# EAGLE schematic CoCoQuadLink (EAGLE 7.7.0)

## Sheet 1 of 7: LOGIC
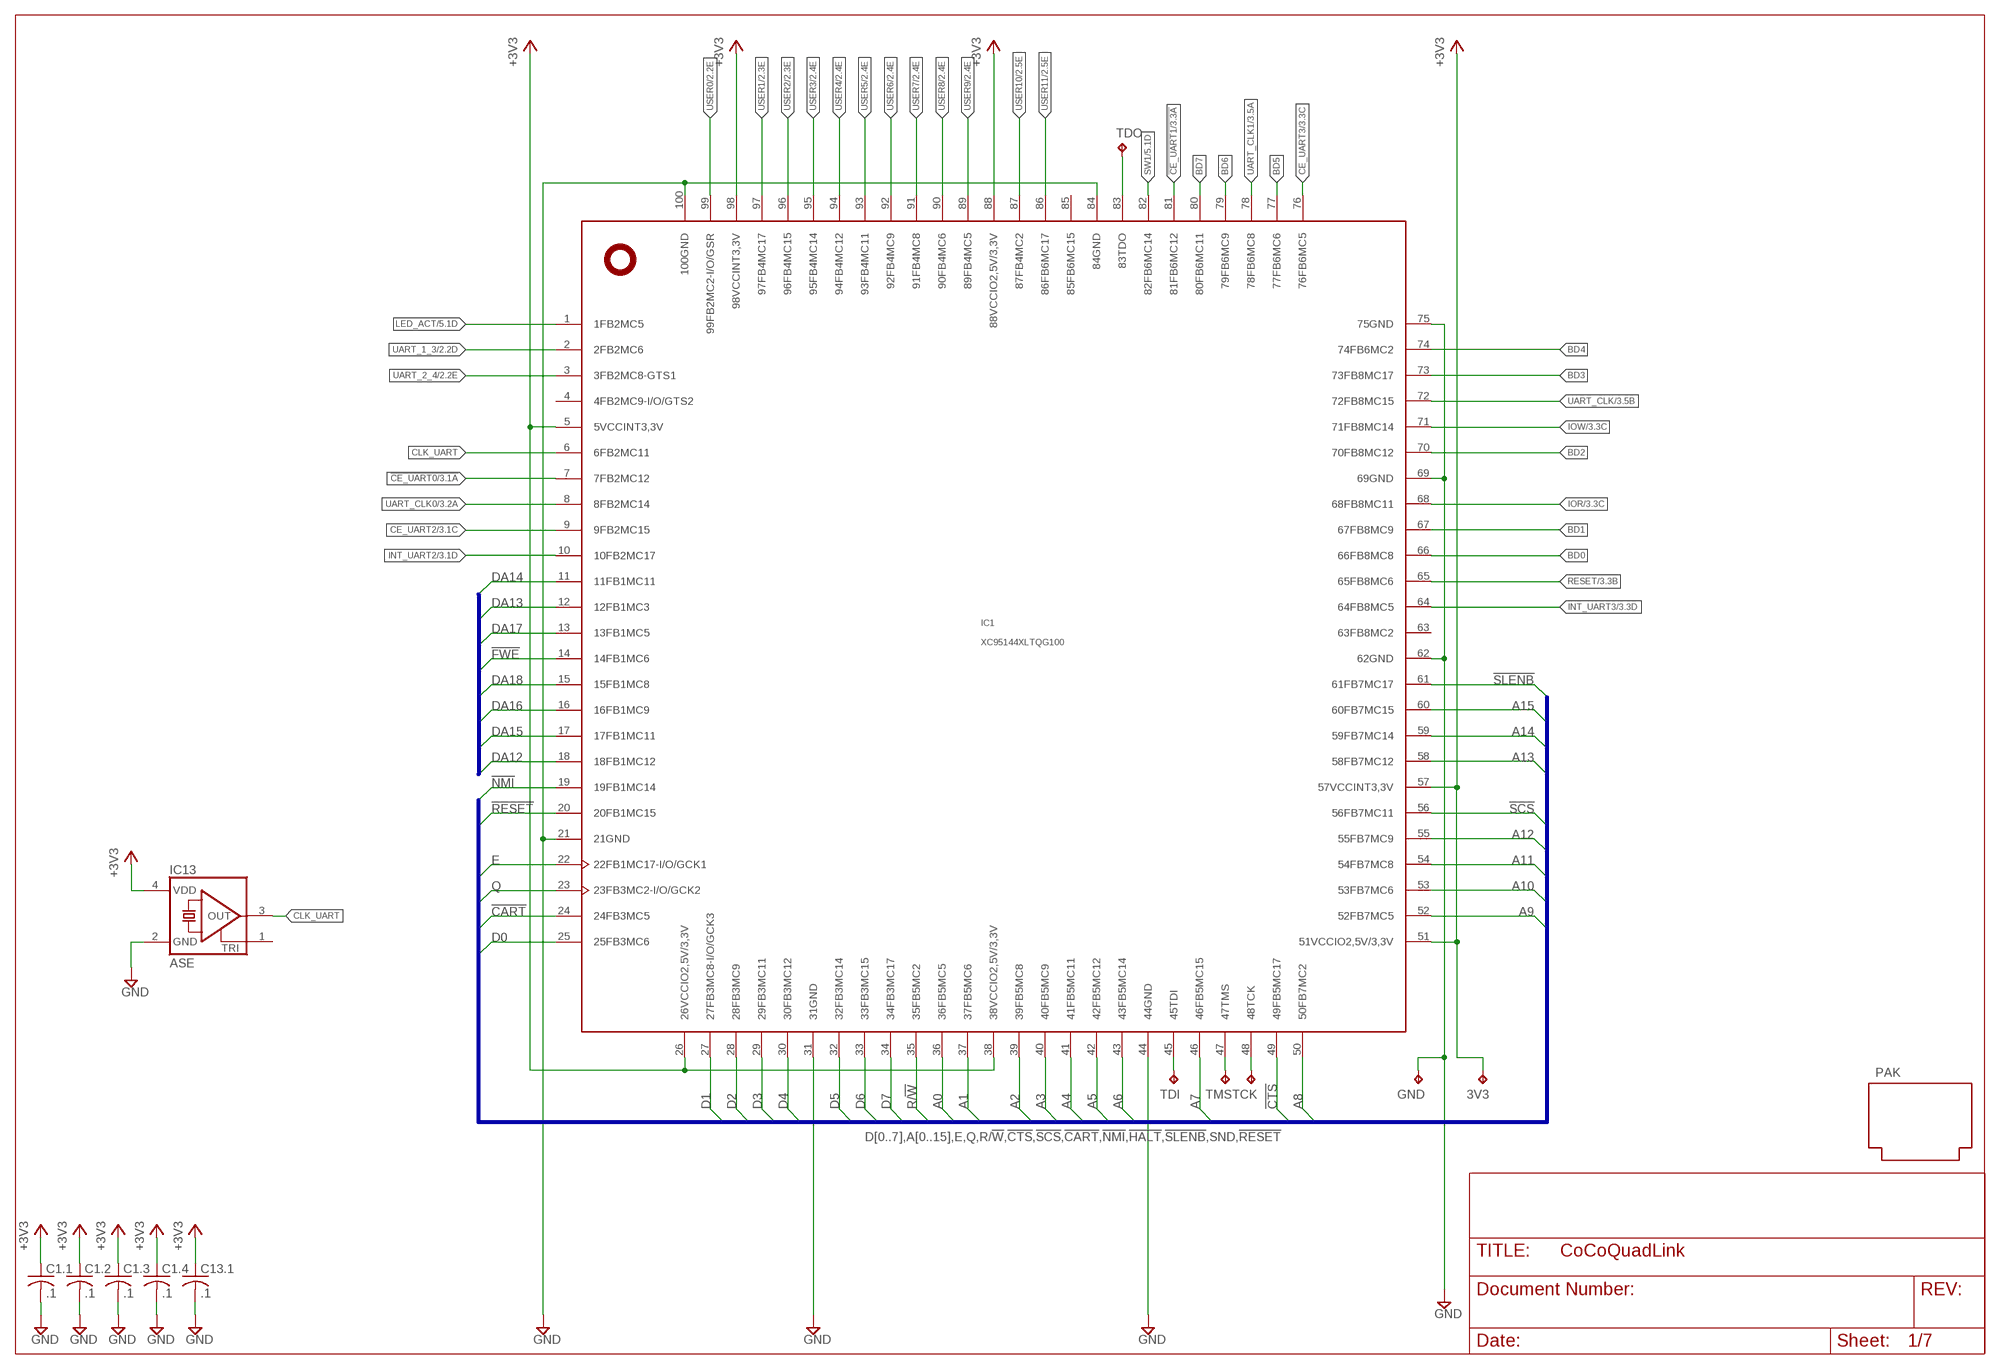
[diagram p0: schematic, sheet 1]

### Parts
3V3  TPTP10R  [TP10R]
C1.1  .1  C-USC0402  [C0402]
C1.2  .1  C-USC0402  [C0402]
C1.3  .1  C-USC0402  [C0402]
C1.4  .1  C-USC0402  [C0402]
C13.1  .1  C-USC0402  [C0402]
GND  TPTP10R  [TP10R]
IC1  XC95144XLTQG100  [TQFP100]
IC13  ASE  [ASE]
PAK  PROGRAM_PAK  [PROGRAM_PAK]
TCK  TPTP10R  [TP10R]
TDI  TPTP10R  [TP10R]
TDO  TPTP10R  [TP10R]
TMS  TPTP10R  [TP10R]

### Nets
!CART: IC1.24(24FB3MC5) ; also sheet 3,6
!CE_UART0: IC1.7(7FB2MC12) ; also sheet 3
!CE_UART1: IC1.81(81FB6MC12) ; also sheet 3
!CTS: IC1.49(49FB5MC17) ; also sheet 4,6
!FWE: IC1.14(14FB1MC6) ; also sheet 4
!NMI: IC1.19(19FB1MC14) ; also sheet 6
!RESET: IC1.20(20FB1MC15) ; also sheet 3,5,6
!SCS: IC1.56(56FB7MC11) ; also sheet 6
!SLENB: IC1.61(61FB7MC17) ; also sheet 6
+3V3: 3V3.TP C1.1.1 C1.2.1 C1.3.1 C1.4.1 C13.1.1 IC1.5(5VCCINT3,3V) IC1.26(26VCCIO2,5V/3,3V) IC1.38(38VCCIO2,5V/3,3V) IC1.51(51VCCIO2,5V/3,3V) IC1.57(57VCCINT3,3V) IC1.88(88VCCIO2,5V/3,3V) IC1.98(98VCCINT3,3V) IC13.4(VDD) ; also sheet 2,5,7
A0: IC1.36(36FB5MC5) ; also sheet 3,4,6
A1: IC1.37(37FB5MC6) ; also sheet 3,4,6
A2: IC1.39(39FB5MC8) ; also sheet 3,4,6
A3: IC1.40(40FB5MC9) ; also sheet 4,6
A4: IC1.41(41FB5MC11) ; also sheet 4,6
A5: IC1.42(42FB5MC12) ; also sheet 4,6
A6: IC1.43(43FB5MC14) ; also sheet 4,6
A7: IC1.46(46FB5MC15) ; also sheet 4,6
A8: IC1.50(50FB7MC2) ; also sheet 4,6
A9: IC1.52(52FB7MC5) ; also sheet 4,6
A10: IC1.53(53FB7MC6) ; also sheet 4,6
A11: IC1.54(54FB7MC8) ; also sheet 4,6
A12: IC1.55(55FB7MC9) ; also sheet 6
A13: IC1.58(58FB7MC12) ; also sheet 6
A14: IC1.59(59FB7MC14) ; also sheet 6
A15: IC1.60(60FB7MC15) ; also sheet 6
BD0: IC1.66(66FB8MC8) ; also sheet 3
BD1: IC1.67(67FB8MC9) ; also sheet 3
BD2: IC1.70(70FB8MC12) ; also sheet 3
BD3: IC1.73(73FB8MC17) ; also sheet 3
BD4: IC1.74(74FB6MC2) ; also sheet 3
BD5: IC1.77(77FB6MC6) ; also sheet 3
BD6: IC1.79(79FB6MC9) ; also sheet 3
BD7: IC1.80(80FB6MC11) ; also sheet 3
CE_UART2: IC1.9(9FB2MC15) ; also sheet 3
CE_UART3: IC1.76(76FB6MC5) ; also sheet 3
CLK_UART: IC1.6(6FB2MC11) IC13.3(OUT)
D0: IC1.25(25FB3MC6) ; also sheet 4,6
D1: IC1.27(27FB3MC8-I/O/GCK3) ; also sheet 4,6
D2: IC1.28(28FB3MC9) ; also sheet 4,6
D3: IC1.29(29FB3MC11) ; also sheet 4,6
D4: IC1.30(30FB3MC12) ; also sheet 4,6
D5: IC1.32(32FB3MC14) ; also sheet 4,6
D6: IC1.33(33FB3MC15) ; also sheet 4,6
D7: IC1.34(34FB3MC17) ; also sheet 4,6
DA12: IC1.18(18FB1MC12) ; also sheet 4
DA13: IC1.12(12FB1MC3) ; also sheet 4
DA14: IC1.11(11FB1MC11) ; also sheet 4
DA15: IC1.17(17FB1MC11) ; also sheet 4
DA16: IC1.16(16FB1MC9) ; also sheet 4
DA17: IC1.13(13FB1MC5) ; also sheet 4
DA18: IC1.15(15FB1MC8) ; also sheet 4
E: IC1.22(22FB1MC17-I/O/GCK1) ; also sheet 3,6
GND: C1.1.2 C1.2.2 C1.3.2 C1.4.2 C13.1.2 GND.TP IC1.21(21GND) IC1.31(31GND) IC1.44(44GND) IC1.62(62GND) IC1.69(69GND) IC1.75(75GND) IC1.84(84GND) IC1.100(100GND) IC13.2(GND) ; also sheet 2,3,4,5,6,7
INT_UART2: IC1.10(10FB2MC17) ; also sheet 3
INT_UART3: IC1.64(64FB8MC5) ; also sheet 3
IOR: IC1.68(68FB8MC11) ; also sheet 3
IOW: IC1.71(71FB8MC14) ; also sheet 3
LED_ACT: IC1.1(1FB2MC5) ; also sheet 5
N$5: IC1.45(45TDI) TDI.TP
N$6: IC1.47(47TMS) TMS.TP
N$7: IC1.48(48TCK) TCK.TP
N$8: IC1.83(83TDO) TDO.TP
Q: IC1.23(23FB3MC2-I/O/GCK2) ; also sheet 6
R/!W: IC1.35(35FB5MC2) ; also sheet 3,6
RESET: IC1.65(65FB8MC6) ; also sheet 3
SW1: IC1.82(82FB6MC14) ; also sheet 5
UART_1_3: IC1.2(2FB2MC6) ; also sheet 2
UART_2_4: IC1.3(3FB2MC8-GTS1) ; also sheet 2
UART_CLK: IC1.72(72FB8MC15) ; also sheet 3
UART_CLK0: IC1.8(8FB2MC14) ; also sheet 3
UART_CLK1: IC1.78(78FB6MC8) ; also sheet 3
USER0: IC1.99(99FB2MC2-I/O/GSR) ; also sheet 2
USER1: IC1.97(97FB4MC17) ; also sheet 2
USER2: IC1.96(96FB4MC15) ; also sheet 2
USER3: IC1.95(95FB4MC14) ; also sheet 2
USER4: IC1.94(94FB4MC12) ; also sheet 2
USER5: IC1.93(93FB4MC11) ; also sheet 2
USER6: IC1.92(92FB4MC9) ; also sheet 2
USER7: IC1.91(91FB4MC8) ; also sheet 2
USER8: IC1.90(90FB4MC6) ; also sheet 2
USER9: IC1.89(89FB4MC5) ; also sheet 2
USER10: IC1.87(87FB4MC2) ; also sheet 2
USER11: IC1.86(86FB6MC17) ; also sheet 2
Unconnected: IC1.4(4FB2MC9-I/O/GTS2) IC1.63(63FB8MC2) IC1.85(85FB6MC15) IC13.1(TRI)

### Buses
D[0..7],A[0..15],E,Q,R/!W,!CTS,!SCS,!CART,!NMI,!HALT,!SLENB,SND,!RESET
!FWE,DA[12..18]

## Sheet 2 of 7: MUX
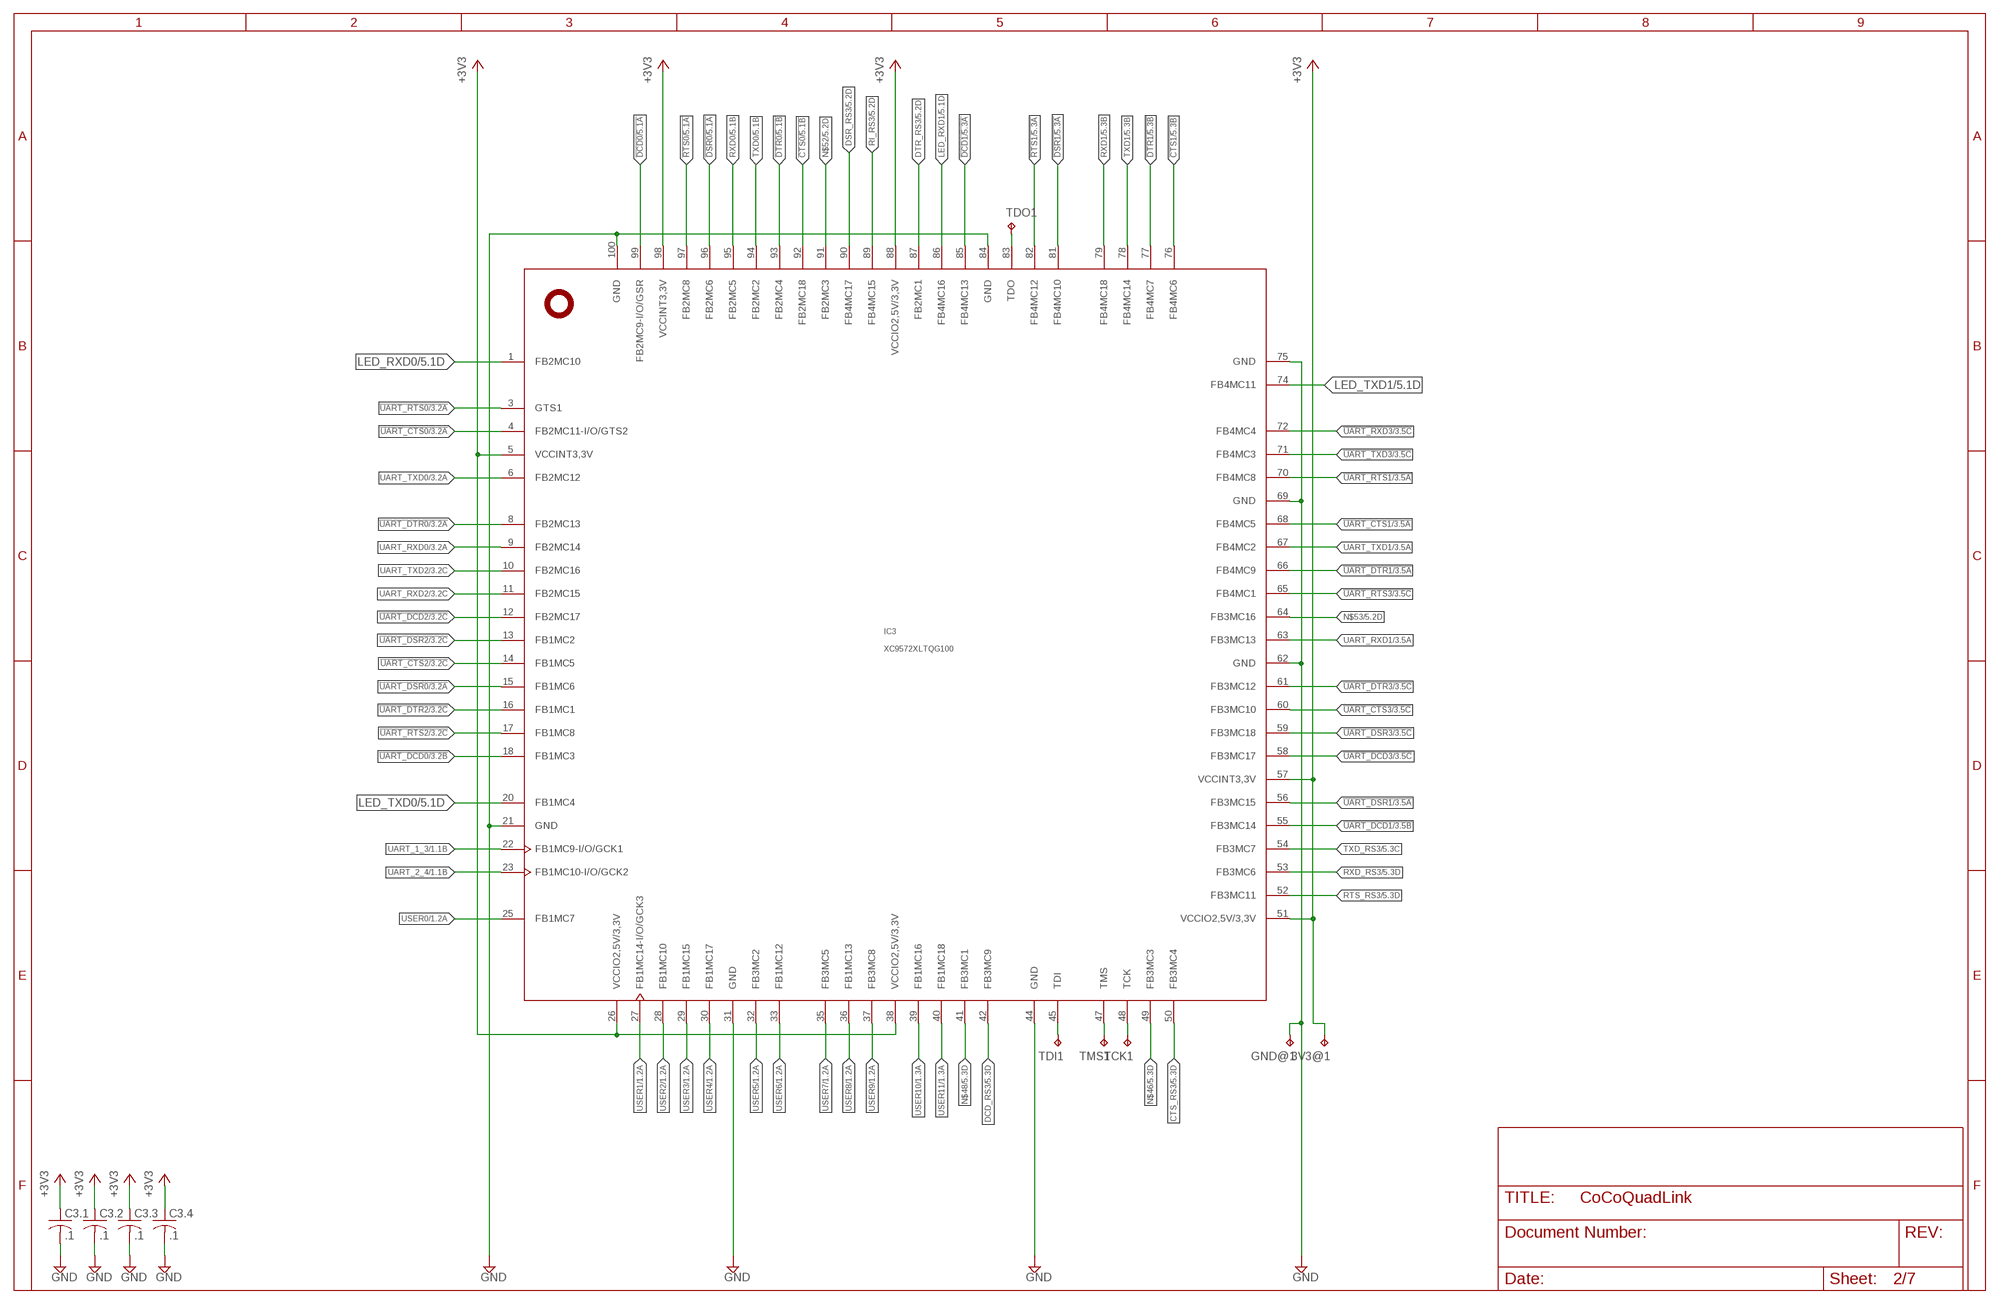
[diagram p1: schematic, sheet 2]

### Parts
3V3@1  TPTP10R  [TP10R]
C3.1  .1  C-USC0402  [C0402]
C3.2  .1  C-USC0402  [C0402]
C3.3  .1  C-USC0402  [C0402]
C3.4  .1  C-USC0402  [C0402]
GND@1  TPTP10R  [TP10R]
IC3  XC9572XLTQG100  [TQFP100]
TCK1  TPTP10R  [TP10R]
TDI1  TPTP10R  [TP10R]
TDO1  TPTP10R  [TP10R]
TMS1  TPTP10R  [TP10R]

### Nets
!CTS0: IC3.92(FB2MC18) ; also sheet 5
!CTS1: IC3.76(FB4MC6) ; also sheet 5
!DCD0: IC3.99(FB2MC9-I/O/GSR) ; also sheet 5
!DCD1: IC3.85(FB4MC13) ; also sheet 5
!DSR0: IC3.96(FB2MC6) ; also sheet 5
!DSR1: IC3.81(FB4MC10) ; also sheet 5
!DTR0: IC3.93(FB2MC4) ; also sheet 5
!DTR1: IC3.77(FB4MC7) ; also sheet 5
!RTS0: IC3.97(FB2MC8) ; also sheet 5
!RTS1: IC3.82(FB4MC12) ; also sheet 5
!UART_CTS0: IC3.4(FB2MC11-I/O/GTS2) ; also sheet 3
!UART_CTS1: IC3.68(FB4MC5) ; also sheet 3
!UART_CTS2: IC3.14(FB1MC5) ; also sheet 3
!UART_CTS3: IC3.60(FB3MC10) ; also sheet 3
!UART_DCD0: IC3.18(FB1MC3) ; also sheet 3
!UART_DCD1: IC3.55(FB3MC14) ; also sheet 3
!UART_DCD2: IC3.12(FB2MC17) ; also sheet 3
!UART_DCD3: IC3.58(FB3MC17) ; also sheet 3
!UART_DSR0: IC3.15(FB1MC6) ; also sheet 3
!UART_DSR1: IC3.56(FB3MC15) ; also sheet 3
!UART_DSR2: IC3.13(FB1MC2) ; also sheet 3
!UART_DSR3: IC3.59(FB3MC18) ; also sheet 3
!UART_DTR0: IC3.8(FB2MC13) ; also sheet 3
!UART_DTR1: IC3.66(FB4MC9) ; also sheet 3
!UART_DTR2: IC3.16(FB1MC1) ; also sheet 3
!UART_DTR3: IC3.61(FB3MC12) ; also sheet 3
!UART_RTS0: IC3.3(GTS1) ; also sheet 3
!UART_RTS1: IC3.70(FB4MC8) ; also sheet 3
!UART_RTS2: IC3.17(FB1MC8) ; also sheet 3
!UART_RTS3: IC3.65(FB4MC1) ; also sheet 3
!UART_RXD3: IC3.72(FB4MC4) ; also sheet 3
!UART_TXD3: IC3.71(FB4MC3) ; also sheet 3
+3V3: 3V3@1.TP C3.1.1 C3.2.1 C3.3.1 C3.4.1 IC3.5(VCCINT3,3V) IC3.26(VCCIO2,5V/3,3V) IC3.38(VCCIO2,5V/3,3V) IC3.51(VCCIO2,5V/3,3V) IC3.57(VCCINT3,3V) IC3.88(VCCIO2,5V/3,3V) IC3.98(VCCINT3,3V) ; also sheet 1,5,7
CTS_RS3: IC3.50(FB3MC4) ; also sheet 5
DCD_RS3: IC3.42(FB3MC9) ; also sheet 5
DSR_RS3: IC3.90(FB4MC17) ; also sheet 5
DTR_RS3: IC3.87(FB2MC1) ; also sheet 5
GND: C3.1.2 C3.2.2 C3.3.2 C3.4.2 GND@1.TP IC3.21(GND) IC3.31(GND) IC3.44(GND) IC3.62(GND) IC3.69(GND) IC3.75(GND) IC3.84(GND) IC3.100(GND) ; also sheet 1,3,4,5,6,7
LED_RXD0: IC3.1(FB2MC10) ; also sheet 5
LED_RXD1: IC3.86(FB4MC16) ; also sheet 5
LED_TXD0: IC3.20(FB1MC4) ; also sheet 5
LED_TXD1: IC3.74(FB4MC11) ; also sheet 5
N$11: IC3.83(TDO) TDO1.TP
N$12: IC3.45(TDI) TDI1.TP
N$30: IC3.47(TMS) TMS1.TP
N$32: IC3.48(TCK) TCK1.TP
N$46: IC3.49(FB3MC3) ; also sheet 5
N$48: IC3.41(FB3MC1) ; also sheet 5
N$52: IC3.91(FB2MC3) ; also sheet 5
N$53: IC3.64(FB3MC16) ; also sheet 5
RI_RS3: IC3.89(FB4MC15) ; also sheet 5
RTS_RS3: IC3.52(FB3MC11) ; also sheet 5
RXD0: IC3.95(FB2MC5) ; also sheet 5
RXD1: IC3.79(FB4MC18) ; also sheet 5
RXD_RS3: IC3.53(FB3MC6) ; also sheet 5
TXD0: IC3.94(FB2MC2) ; also sheet 5
TXD1: IC3.78(FB4MC14) ; also sheet 5
TXD_RS3: IC3.54(FB3MC7) ; also sheet 5
UART_1_3: IC3.22(FB1MC9-I/O/GCK1) ; also sheet 1
UART_2_4: IC3.23(FB1MC10-I/O/GCK2) ; also sheet 1
UART_RXD0: IC3.9(FB2MC14) ; also sheet 3
UART_RXD1: IC3.63(FB3MC13) ; also sheet 3
UART_RXD2: IC3.11(FB2MC15) ; also sheet 3
UART_TXD0: IC3.6(FB2MC12) ; also sheet 3
UART_TXD1: IC3.67(FB4MC2) ; also sheet 3
UART_TXD2: IC3.10(FB2MC16) ; also sheet 3
USER0: IC3.25(FB1MC7) ; also sheet 1
USER1: IC3.27(FB1MC14-I/O/GCK3) ; also sheet 1
USER2: IC3.28(FB1MC10) ; also sheet 1
USER3: IC3.29(FB1MC15) ; also sheet 1
USER4: IC3.30(FB1MC17) ; also sheet 1
USER5: IC3.32(FB3MC2) ; also sheet 1
USER6: IC3.33(FB1MC12) ; also sheet 1
USER7: IC3.35(FB3MC5) ; also sheet 1
USER8: IC3.36(FB1MC13) ; also sheet 1
USER9: IC3.37(FB3MC8) ; also sheet 1
USER10: IC3.39(FB1MC16) ; also sheet 1
USER11: IC3.40(FB1MC18) ; also sheet 1

## Sheet 3 of 7: UART
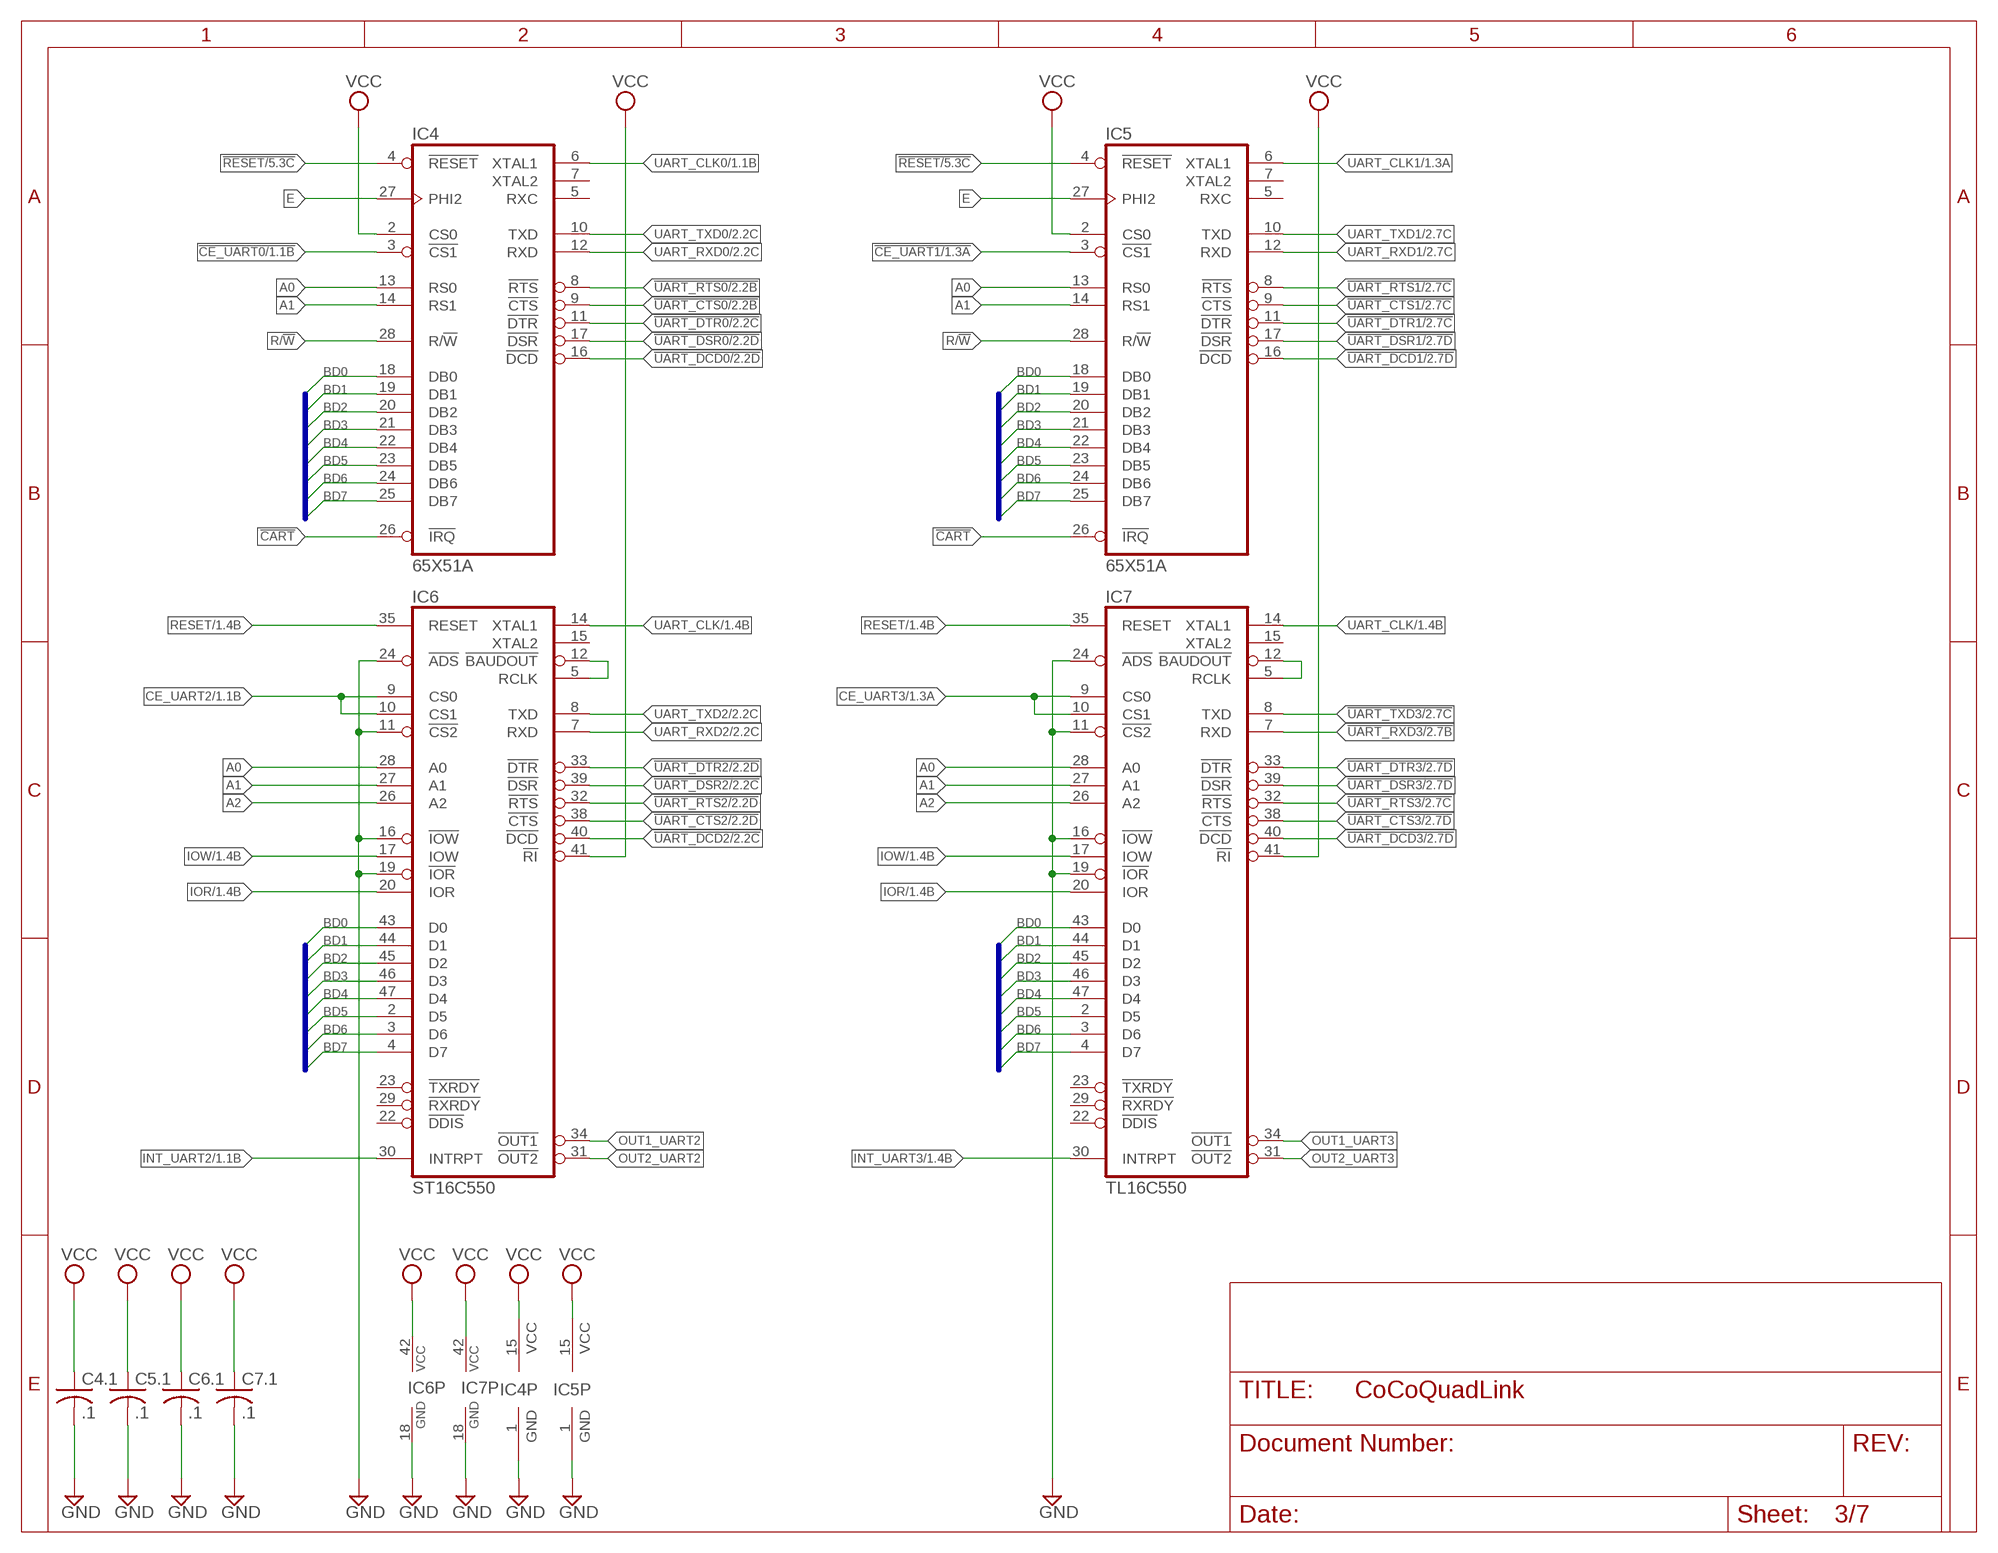
[diagram p2: schematic, sheet 3]

### Parts
C4.1  .1  C-USC0402  [C0402]
C5.1  .1  C-USC0402  [C0402]
C6.1  .1  C-USC0402  [C0402]
C7.1  .1  C-USC0402  [C0402]
IC4  65X51A  6551NR  [DIL28-ROUNDPAD]
IC5  65X51A  6551NR  [DIL28-ROUNDPAD]
IC6  ST16C550  TLC550PT  [LQFP48]
IC7  TL16C550  TLC550PT  [LQFP48]

### Nets
!CART: IC4.26(!IRQ) IC5.26(!IRQ) ; also sheet 1,6
!CE_UART0: IC4.3(!CS1) ; also sheet 1
!CE_UART1: IC5.3(!CS1) ; also sheet 1
!RESET: IC4.4(!RESET) IC5.4(!RESET) ; also sheet 1,5,6
!UART_CTS0: IC4.9(!CTS) ; also sheet 2
!UART_CTS1: IC5.9(!CTS) ; also sheet 2
!UART_CTS2: IC6.38(!CTS) ; also sheet 2
!UART_CTS3: IC7.38(!CTS) ; also sheet 2
!UART_DCD0: IC4.16(!DCD) ; also sheet 2
!UART_DCD1: IC5.16(!DCD) ; also sheet 2
!UART_DCD2: IC6.40(!DCD) ; also sheet 2
!UART_DCD3: IC7.40(!DCD) ; also sheet 2
!UART_DSR0: IC4.17(!DSR) ; also sheet 2
!UART_DSR1: IC5.17(!DSR) ; also sheet 2
!UART_DSR2: IC6.39(!DSR) ; also sheet 2
!UART_DSR3: IC7.39(!DSR) ; also sheet 2
!UART_DTR0: IC4.11(!DTR) ; also sheet 2
!UART_DTR1: IC5.11(!DTR) ; also sheet 2
!UART_DTR2: IC6.33(!DTR) ; also sheet 2
!UART_DTR3: IC7.33(!DTR) ; also sheet 2
!UART_RTS0: IC4.8(!RTS) ; also sheet 2
!UART_RTS1: IC5.8(!RTS) ; also sheet 2
!UART_RTS2: IC6.32(!RTS) ; also sheet 2
!UART_RTS3: IC7.32(!RTS) ; also sheet 2
!UART_RXD3: IC7.7(RXD) ; also sheet 2
!UART_TXD3: IC7.8(TXD) ; also sheet 2
A0: IC4.13(RS0) IC5.13(RS0) IC6.28(A0) IC7.28(A0) ; also sheet 1,4,6
A1: IC4.14(RS1) IC5.14(RS1) IC6.27(A1) IC7.27(A1) ; also sheet 1,4,6
A2: IC6.26(A2) IC7.26(A2) ; also sheet 1,4,6
BD0: IC4.18(DB0) IC5.18(DB0) IC6.43(D0) IC7.43(D0) ; also sheet 1
BD1: IC4.19(DB1) IC5.19(DB1) IC6.44(D1) IC7.44(D1) ; also sheet 1
BD2: IC4.20(DB2) IC5.20(DB2) IC6.45(D2) IC7.45(D2) ; also sheet 1
BD3: IC4.21(DB3) IC5.21(DB3) IC6.46(D3) IC7.46(D3) ; also sheet 1
BD4: IC4.22(DB4) IC5.22(DB4) IC6.47(D4) IC7.47(D4) ; also sheet 1
BD5: IC4.23(DB5) IC5.23(DB5) IC6.2(D5) IC7.2(D5) ; also sheet 1
BD6: IC4.24(DB6) IC5.24(DB6) IC6.3(D6) IC7.3(D6) ; also sheet 1
BD7: IC4.25(DB7) IC5.25(DB7) IC6.4(D7) IC7.4(D7) ; also sheet 1
CE_UART2: IC6.9(CS0) IC6.10(CS1) ; also sheet 1
CE_UART3: IC7.9(CS0) IC7.10(CS1) ; also sheet 1
E: IC4.27(PHI2) IC5.27(PHI2) ; also sheet 1,6
GND: C4.1.2 C5.1.2 C6.1.2 C7.1.2 IC4.1(GND) IC5.1(GND) IC6.11(!CS2) IC6.16(!IOW) IC6.18(GND) IC6.19(!IOR) IC6.24(!ADS) IC7.11(!CS2) IC7.16(!IOW) IC7.18(GND) IC7.19(!IOR) IC7.24(!ADS) ; also sheet 1,2,4,5,6,7
INT_UART2: IC6.30(INTRPT) ; also sheet 1
INT_UART3: IC7.30(INTRPT) ; also sheet 1
IOR: IC6.20(IOR) IC7.20(IOR) ; also sheet 1
IOW: IC6.17(IOW) IC7.17(IOW) ; also sheet 1
N$33: IC6.5(RCLK) IC6.12(!BAUDOUT)
N$35: IC7.5(RCLK) IC7.12(!BAUDOUT)
OUT1_UART2: IC6.34(!OUT1)
OUT1_UART3: IC7.34(!OUT1)
OUT2_UART2: IC6.31(!OUT2)
OUT2_UART3: IC7.31(!OUT2)
R/!W: IC4.28(R/!W) IC5.28(R/!W) ; also sheet 1,6
RESET: IC6.35(RESET) IC7.35(RESET) ; also sheet 1
UART_CLK: IC6.14(XTAL1) IC7.14(XTAL1) ; also sheet 1
UART_CLK0: IC4.6(XTAL1) ; also sheet 1
UART_CLK1: IC5.6(XTAL1) ; also sheet 1
UART_RXD0: IC4.12(RXD) ; also sheet 2
UART_RXD1: IC5.12(RXD) ; also sheet 2
UART_RXD2: IC6.7(RXD) ; also sheet 2
UART_TXD0: IC4.10(TXD) ; also sheet 2
UART_TXD1: IC5.10(TXD) ; also sheet 2
UART_TXD2: IC6.8(TXD) ; also sheet 2
VCC: C4.1.1 C5.1.1 C6.1.1 C7.1.1 IC4.2(CS0) IC4.15(VCC) IC5.2(CS0) IC5.15(VCC) IC6.41(!RI) IC6.42(VCC) IC7.41(!RI) IC7.42(VCC) ; also sheet 4,5,6,7
Unconnected: IC4.5(RXC) IC4.7(XTAL2) IC5.5(RXC) IC5.7(XTAL2) IC6.15(XTAL2) IC6.22(!DDIS) IC6.23(!TXRDY) IC6.29(!RXRDY) IC7.15(XTAL2) IC7.22(!DDIS) IC7.23(!TXRDY) IC7.29(!RXRDY)

### Buses
BD[0..7]

## Sheet 4 of 7: MEMORY
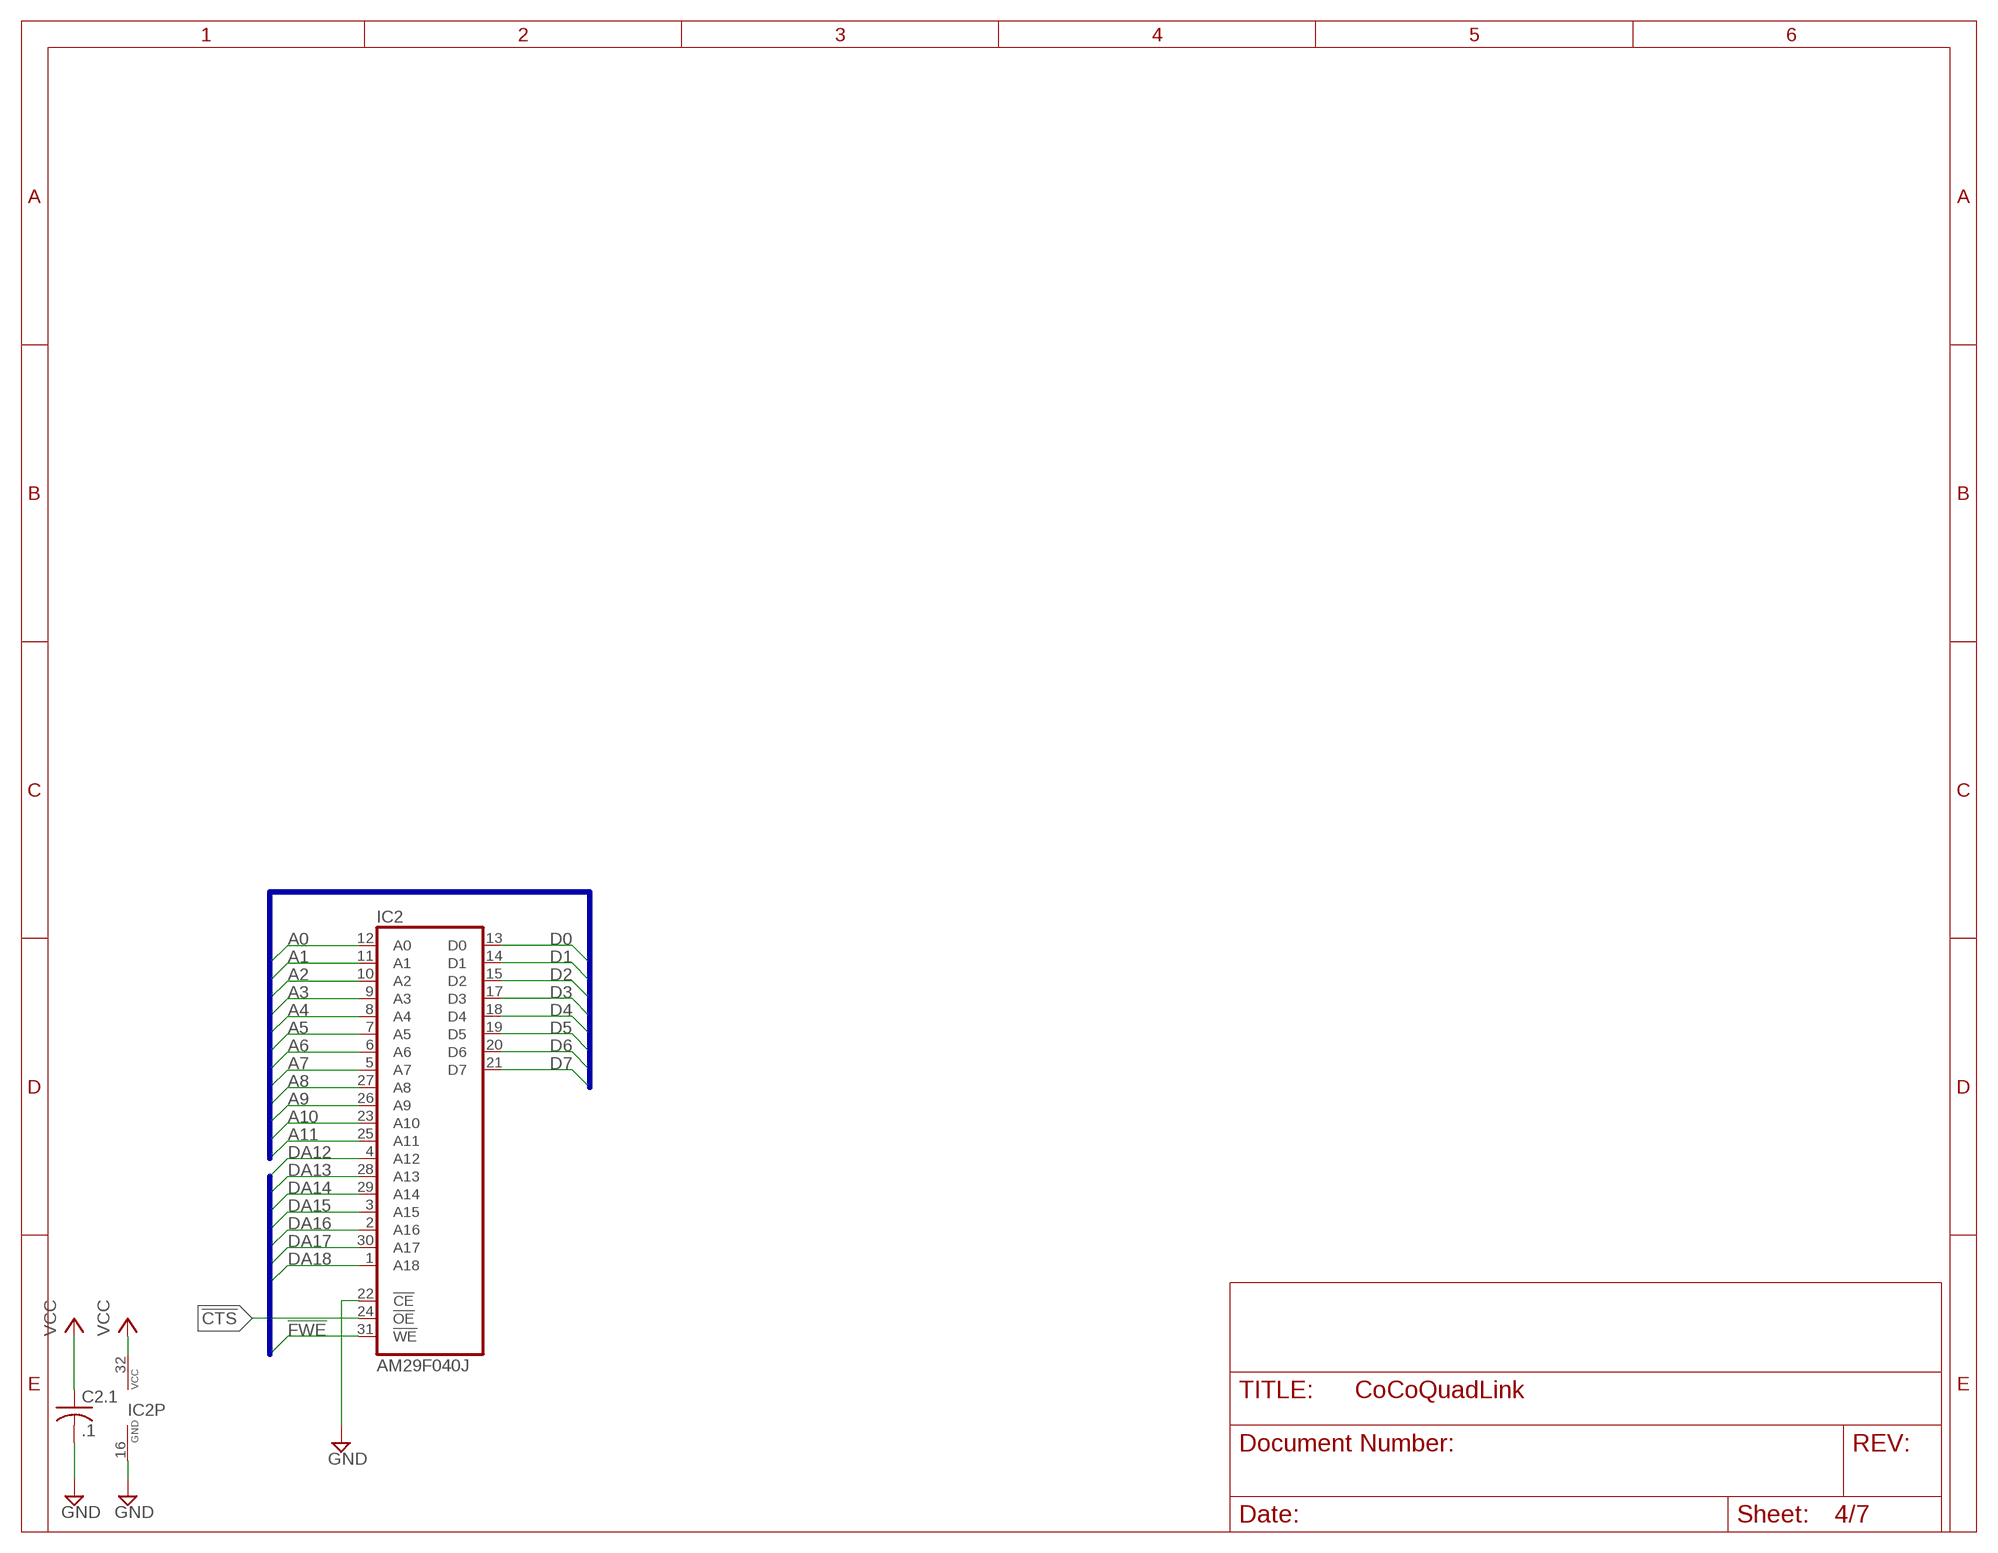
[diagram p3: schematic, sheet 4]

### Parts
C2.1  .1  C-USC0402  [C0402]
IC2  AM29F040J  [PLCC32R]

### Nets
!CTS: IC2.24(!OE) ; also sheet 1,6
!FWE: IC2.31(!WE) ; also sheet 1
A0: IC2.12(A0) ; also sheet 1,3,6
A1: IC2.11(A1) ; also sheet 1,3,6
A2: IC2.10(A2) ; also sheet 1,3,6
A3: IC2.9(A3) ; also sheet 1,6
A4: IC2.8(A4) ; also sheet 1,6
A5: IC2.7(A5) ; also sheet 1,6
A6: IC2.6(A6) ; also sheet 1,6
A7: IC2.5(A7) ; also sheet 1,6
A8: IC2.27(A8) ; also sheet 1,6
A9: IC2.26(A9) ; also sheet 1,6
A10: IC2.23(A10) ; also sheet 1,6
A11: IC2.25(A11) ; also sheet 1,6
D0: IC2.13(D0) ; also sheet 1,6
D1: IC2.14(D1) ; also sheet 1,6
D2: IC2.15(D2) ; also sheet 1,6
D3: IC2.17(D3) ; also sheet 1,6
D4: IC2.18(D4) ; also sheet 1,6
D5: IC2.19(D5) ; also sheet 1,6
D6: IC2.20(D6) ; also sheet 1,6
D7: IC2.21(D7) ; also sheet 1,6
DA12: IC2.4(A12) ; also sheet 1
DA13: IC2.28(A13) ; also sheet 1
DA14: IC2.29(A14) ; also sheet 1
DA15: IC2.3(A15) ; also sheet 1
DA16: IC2.2(A16) ; also sheet 1
DA17: IC2.30(A17) ; also sheet 1
DA18: IC2.1(A18) ; also sheet 1
GND: C2.1.2 IC2.16(GND) IC2.22(!CE) ; also sheet 1,2,3,5,6,7
VCC: C2.1.1 IC2.32(VCC) ; also sheet 3,5,6,7

### Buses
!FWE,DA[12..18]
D[0..7],A[0..15],E,Q,R/!W,!CTS,!SCS,!CART,!NMI,!HALT,!SLENB,SND,!RESET

## Sheet 5 of 7: IO
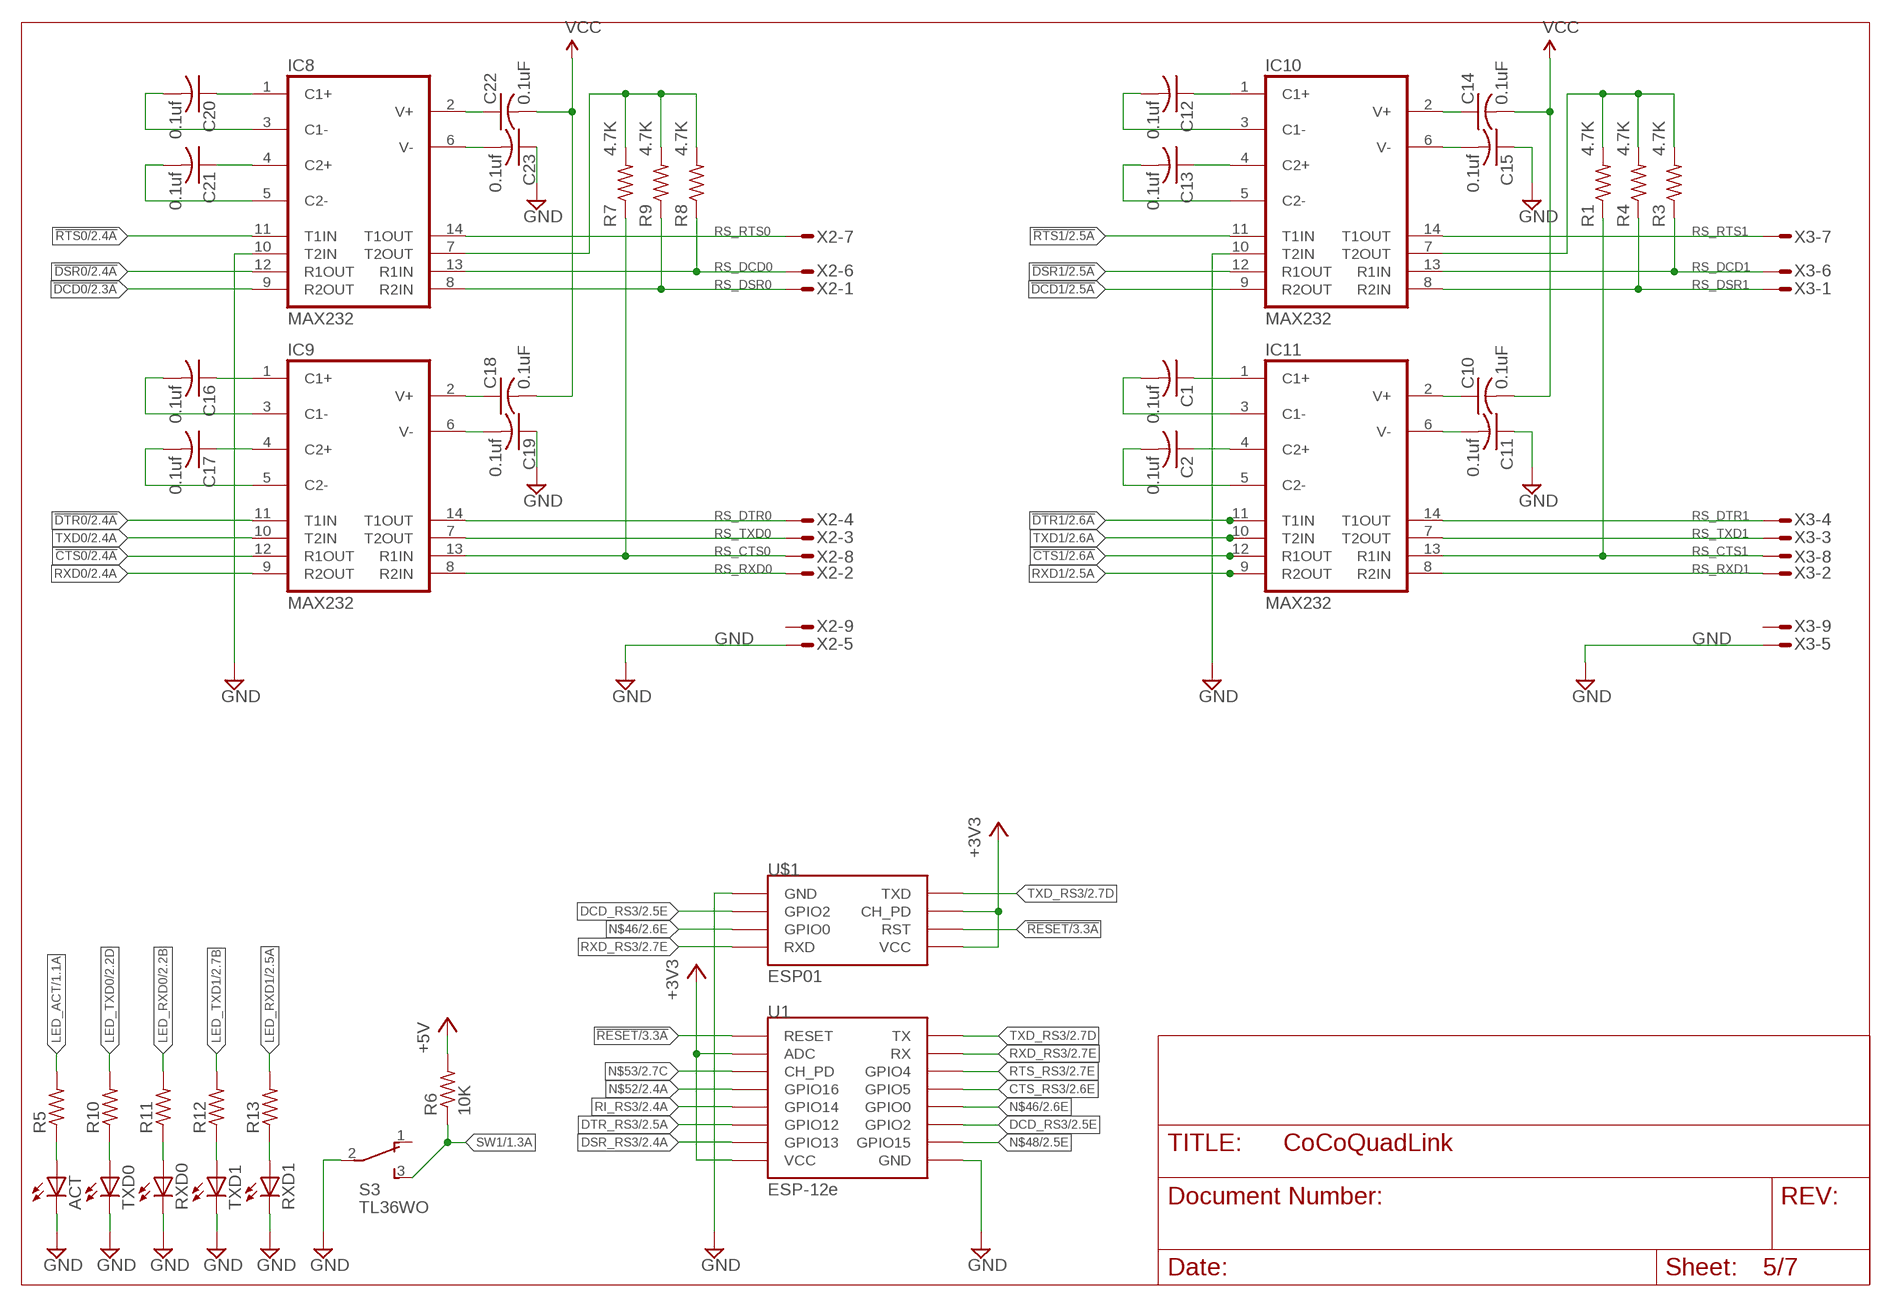
[diagram p4: schematic, sheet 5]

### Parts
ACT  LED3MM  [LED3MM]
C1  0.1uf  C-USC0402  [C0402]
C2  0.1uf  C-USC0402  [C0402]
C10  0.1uF  C-USC0402  [C0402]
C11  0.1uf  C-USC0402  [C0402]
C12  0.1uf  C-USC0402  [C0402]
C13  0.1uf  C-USC0402  [C0402]
C14  0.1uF  C-USC0402  [C0402]
C15  0.1uf  C-USC0402  [C0402]
C16  0.1uf  C-USC0402  [C0402]
C17  0.1uf  C-USC0402  [C0402]
C18  0.1uF  C-USC0402  [C0402]
C19  0.1uf  C-USC0402  [C0402]
C20  0.1uf  C-USC0402  [C0402]
C21  0.1uf  C-USC0402  [C0402]
C22  0.1uF  C-USC0402  [C0402]
C23  0.1uf  C-USC0402  [C0402]
IC8  MAX232  MAX3232CSE  [SO16]
IC9  MAX232  MAX3232CSE  [SO16]
IC10  MAX232  MAX3232CSE  [SO16]
IC11  MAX232  MAX3232CSE  [SO16]
R1  4.7K  R-US_R1206  [R1206]
R3  4.7K  R-US_R1206  [R1206]
R4  4.7K  R-US_R1206  [R1206]
R5  R-US_R0402  [R0402]
R6  10K  R-US_R0402  [R0402]
R7  4.7K  R-US_R1206  [R1206]
R8  4.7K  R-US_R1206  [R1206]
R9  4.7K  R-US_R1206  [R1206]
R10  R-US_R0402  [R0402]
R11  R-US_R0402  [R0402]
R12  R-US_R0402  [R0402]
R13  R-US_R0402  [R0402]
RXD0  LED3MM  [LED3MM]
RXD1  LED3MM  [LED3MM]
S3  TL36WO  [TL3XWO]
TXD0  LED3MM  [LED3MM]
TXD1  LED3MM  [LED3MM]
U1  ESP-12e  ESP12  [ESP12]
U$1  ESP01  [ESP01]
X2  M09DS  [M09D]
X3  M09DS  [M09D]

### Nets
!CTS0: IC9.12(R1OUT) ; also sheet 2
!CTS1: IC11.12(R1OUT) ; also sheet 2
!DCD0: IC8.9(R2OUT) ; also sheet 2
!DCD1: IC10.9(R2OUT) ; also sheet 2
!DSR0: IC8.12(R1OUT) ; also sheet 2
!DSR1: IC10.12(R1OUT) ; also sheet 2
!DTR0: IC9.11(T1IN) ; also sheet 2
!DTR1: IC11.11(T1IN) ; also sheet 2
!RESET: U1.RESET U$1.RST ; also sheet 1,3,6
!RTS0: IC8.11(T1IN) ; also sheet 2
!RTS1: IC10.11(T1IN) ; also sheet 2
+3V3: U1.ADC U1.VCC U$1.CH_PD U$1.VCC ; also sheet 1,2,7
CTS_RS3: U1.GPIO5 ; also sheet 2
DCD_RS3: U1.GPIO2 U$1.GPIO2 ; also sheet 2
DSR_RS3: U1.GPIO13 ; also sheet 2
DTR_RS3: U1.GPIO12 ; also sheet 2
GND: ACT.K(C) C11.1 C15.1 C19.1 C23.1 IC8.10(T2IN) IC10.10(T2IN) RXD0.K(C) RXD1.K(C) S3.2(P) TXD0.K(C) TXD1.K(C) U1.GND U$1.GND X2.5 X3.5 ; also sheet 1,2,3,4,6,7
LED_ACT: R5.2 ; also sheet 1
LED_RXD0: R11.2 ; also sheet 2
LED_RXD1: R13.2 ; also sheet 2
LED_TXD0: R10.2 ; also sheet 2
LED_TXD1: R12.2 ; also sheet 2
N$1: ACT.A R5.1
N$2: C16.1 IC9.1(C1+)
N$3: C16.2 IC9.3(C1-)
N$4: C17.1 IC9.4(C2+)
N$9: C17.2 IC9.5(C2-)
N$10: IC10.7(T2OUT) R1.2 R3.2 R4.2
N$13: C1.1 IC11.1(C1+)
N$14: C18.1 IC9.2(V+)
N$15: C19.2 IC9.6(V-)
N$16: C20.1 IC8.1(C1+)
N$17: C1.2 IC11.3(C1-)
N$18: C2.1 IC11.4(C2+)
N$19: C2.2 IC11.5(C2-)
N$20: C10.1 IC11.2(V+)
N$21: C11.2 IC11.6(V-)
N$22: C12.1 IC10.1(C1+)
N$23: C12.2 IC10.3(C1-)
N$24: C13.1 IC10.4(C2+)
N$25: C20.2 IC8.3(C1-)
N$26: C21.1 IC8.4(C2+)
N$27: C21.2 IC8.5(C2-)
N$28: C22.1 IC8.2(V+)
N$29: C23.2 IC8.6(V-)
N$31: IC8.7(T2OUT) R7.2 R8.2 R9.2
N$34: C13.2 IC10.5(C2-)
N$36: C14.1 IC10.2(V+)
N$37: C15.2 IC10.6(V-)
N$38: R10.1 TXD0.A
N$39: R11.1 RXD0.A
N$40: R12.1 TXD1.A
N$41: R13.1 RXD1.A
N$46: U1.GPIO0 U$1.GPIO0 ; also sheet 2
N$48: U1.GPIO15 ; also sheet 2
N$52: U1.GPIO16 ; also sheet 2
N$53: U1.CH_PD ; also sheet 2
RI_RS3: U1.GPIO14 ; also sheet 2
RS_CTS0: IC9.13(R1IN) R7.1 X2.8
RS_CTS1: IC11.13(R1IN) R1.1 X3.8
RS_DCD0: IC8.13(R1IN) R8.1 X2.6
RS_DCD1: IC10.13(R1IN) R3.1 X3.6
RS_DSR0: IC8.8(R2IN) R9.1 X2.1
RS_DSR1: IC10.8(R2IN) R4.1 X3.1
RS_DTR0: IC9.14(T1OUT) X2.4
RS_DTR1: IC11.14(T1OUT) X3.4
RS_RTS0: IC8.14(T1OUT) X2.7
RS_RTS1: IC10.14(T1OUT) X3.7
RS_RXD0: IC9.8(R2IN) X2.2
RS_RXD1: IC11.8(R2IN) X3.2
RS_TXD0: IC9.7(T2OUT) X2.3
RS_TXD1: IC11.7(T2OUT) X3.3
RTS_RS3: U1.GPIO4 ; also sheet 2
RXD0: IC9.9(R2OUT) ; also sheet 2
RXD1: IC11.9(R2OUT) ; also sheet 2
RXD_RS3: U1.RX U$1.RX(RXD) ; also sheet 2
SW1: R6.1 S3.3(S) ; also sheet 1
TXD0: IC9.10(T2IN) ; also sheet 2
TXD1: IC11.10(T2IN) ; also sheet 2
TXD_RS3: U1.TX U$1.TX(TXD) ; also sheet 2
VCC: C10.2 C14.2 C18.2 C22.2 R6.2 ; supply symbol labelled +5V ; also sheet 3,4,6,7
Unconnected: S3.1(O) X2.9 X3.9

## Sheet 6 of 7: COCO
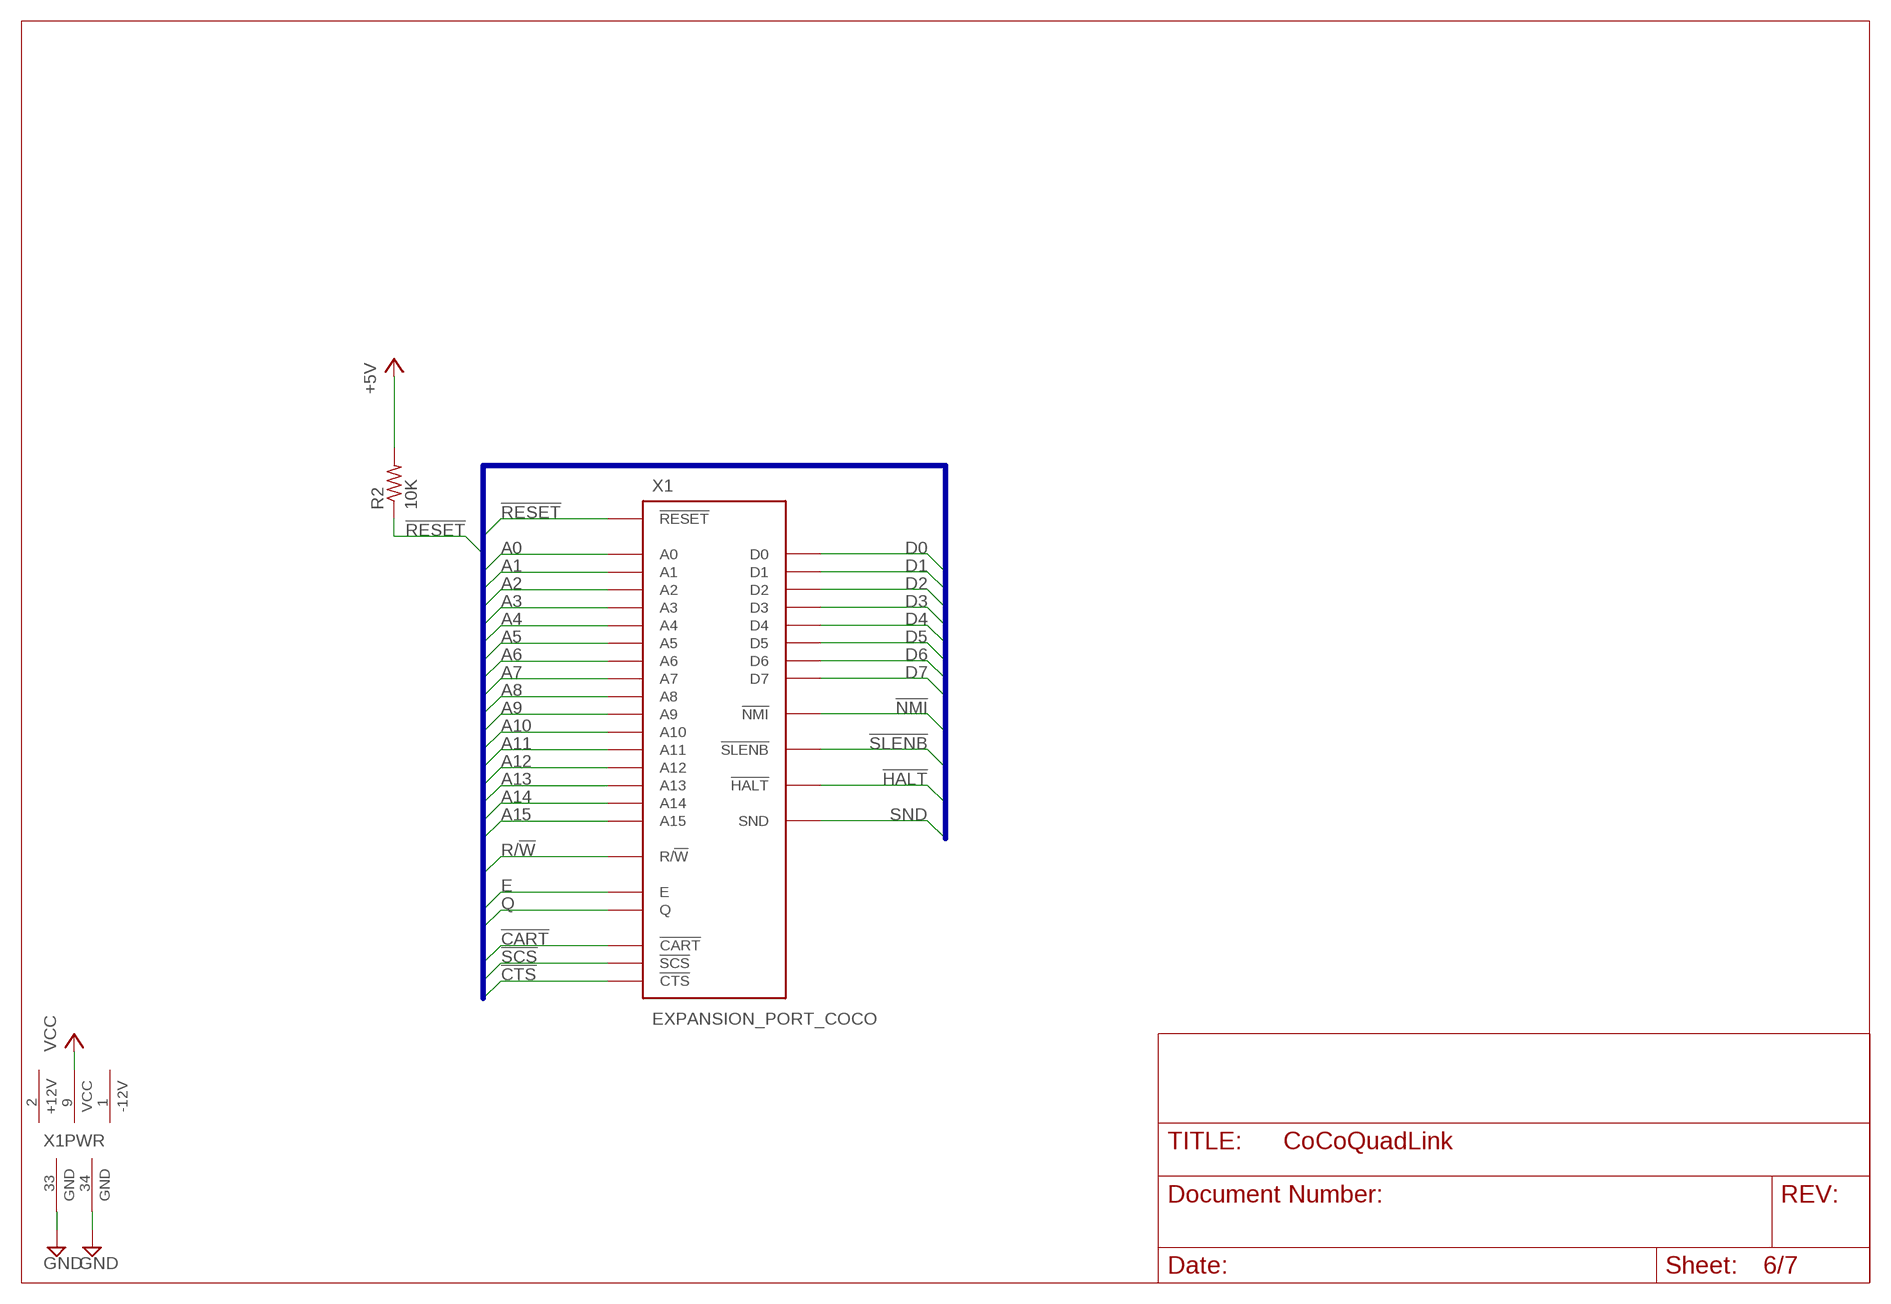
[diagram p5: schematic, sheet 6]

### Parts
R2  10K  R-US_R0402  [R0402]
X1  EXPANSION_PORT_COCO  [MA20-2]

### Nets
!CART: X1.8(!CART) ; also sheet 1,3
!CTS: X1.32(!CTS) ; also sheet 1,4
!HALT: X1.3(!HALT)
!NMI: X1.4(!NMI) ; also sheet 1
!RESET: R2.1 X1.5(!RESET) ; also sheet 1,3,5
!SCS: X1.36(!SCS) ; also sheet 1
!SLENB: X1.40(!SLENB) ; also sheet 1
A0: X1.19(A0) ; also sheet 1,3,4
A1: X1.20(A1) ; also sheet 1,3,4
A2: X1.21(A2) ; also sheet 1,3,4
A3: X1.22(A3) ; also sheet 1,4
A4: X1.23(A4) ; also sheet 1,4
A5: X1.24(A5) ; also sheet 1,4
A6: X1.25(A6) ; also sheet 1,4
A7: X1.26(A7) ; also sheet 1,4
A8: X1.27(A8) ; also sheet 1,4
A9: X1.28(A9) ; also sheet 1,4
A10: X1.29(A10) ; also sheet 1,4
A11: X1.30(A11) ; also sheet 1,4
A12: X1.31(A12) ; also sheet 1
A13: X1.37(A13) ; also sheet 1
A14: X1.38(A14) ; also sheet 1
A15: X1.39(A15) ; also sheet 1
D0: X1.10(D0) ; also sheet 1,4
D1: X1.11(D1) ; also sheet 1,4
D2: X1.12(D2) ; also sheet 1,4
D3: X1.13(D3) ; also sheet 1,4
D4: X1.14(D4) ; also sheet 1,4
D5: X1.15(D5) ; also sheet 1,4
D6: X1.16(D6) ; also sheet 1,4
D7: X1.17(D7) ; also sheet 1,4
E: X1.6(E) ; also sheet 1,3
GND: X1.33(GND) X1.34(GND) ; also sheet 1,2,3,4,5,7
Q: X1.7(Q) ; also sheet 1
R/!W: X1.18(R/!W) ; also sheet 1,3
SND: X1.35(SND)
VCC: R2.2 X1.9(VCC) ; supply symbol labelled +5V ; also sheet 3,4,5,7

### Buses
D[0..7],A[0..15],E,Q,R/!W,!CTS,!SCS,!CART,!NMI,!HALT,!SLENB,SND,!RESET

## Sheet 7 of 7: POWER
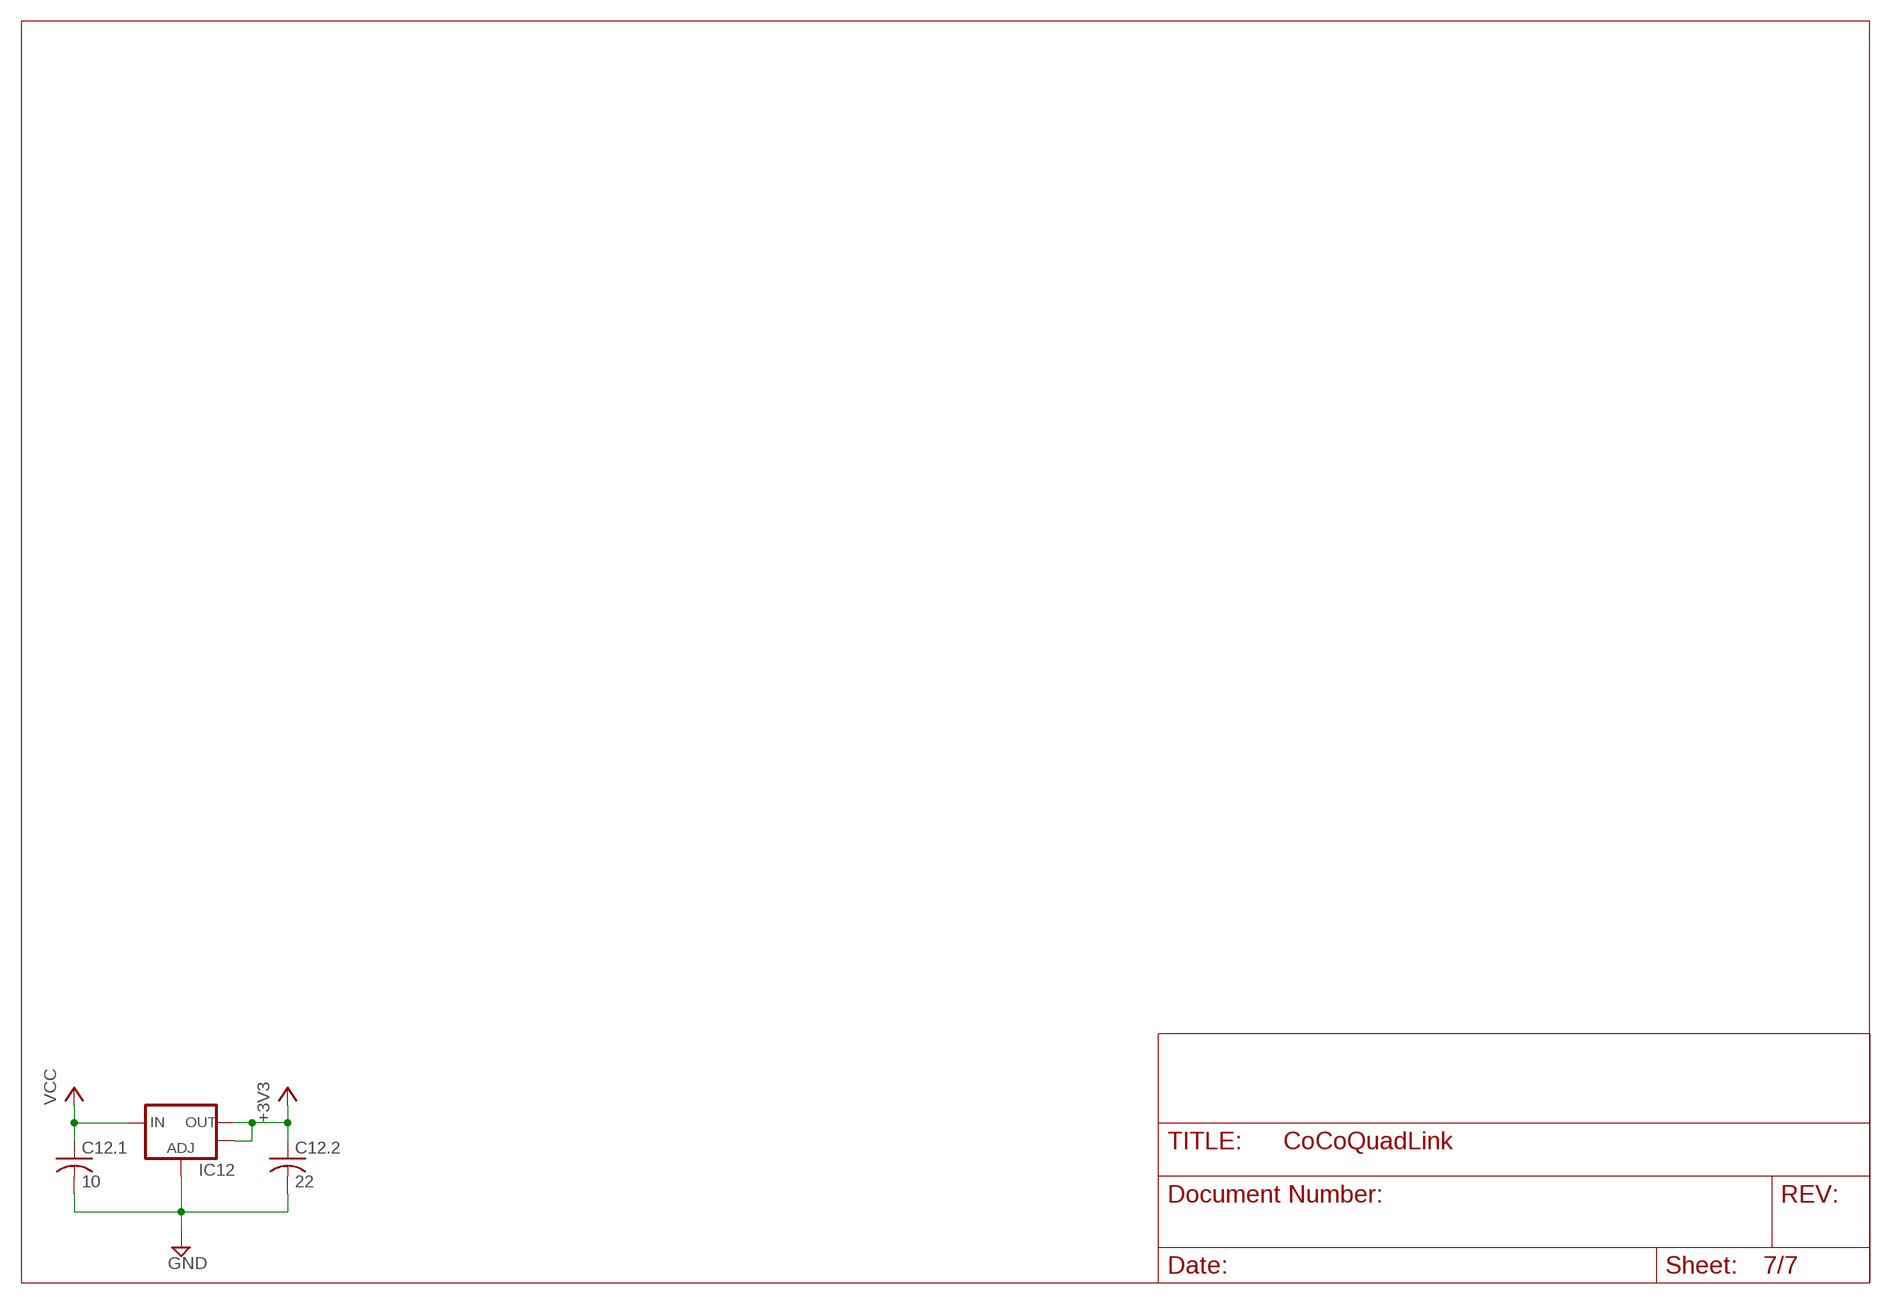
[diagram p6: schematic, sheet 7]

### Parts
C12.1  10  C-USC0805  [C0805]
C12.2  22  C-USC0805  [C0805]
IC12  V_REG_LM1117SOT223  [SOT223]

### Nets
+3V3: C12.2.1 IC12.2(OUT) IC12.4(OUT) ; also sheet 1,2,5
GND: C12.1.2 C12.2.2 IC12.1(ADJ) ; also sheet 1,2,3,4,5,6
VCC: C12.1.1 IC12.3(IN) ; also sheet 3,4,5,6

## Power pins joined to a net without a drawn wire
+12V: X1.2(+12V)
-12V: X1.1(-12V)
GND: IC8.15(GND) IC9.15(GND) IC10.15(GND) IC11.15(GND)
VCC: IC8.16(VCC) IC9.16(VCC) IC10.16(VCC) IC11.16(VCC)

## Library data of the parts
3V3 3V3@1 GND GND@1 TCK TCK1 TDI TDI1 TDO TDO1 TMS TMS1 = testpad:TP: Test pad
ACT RXD0 RXD1 TXD0 TXD1 = led:LED: LED OSRAM: - CHIPLED LG R971, LG N971, LY N971, LG Q971, LY Q971, LO R971, LY R971 LH N974, LH R974 LS Q976, LO Q976, LY Q976 LO Q996 - Hyper CHIPLED LW Q18S LB Q993, LB Q99A, LB R99A - SideLED LS A670, LO A670, LY A670, LG A670, LP A670 LB A673, LV A673, LT A673, LW A673 LH A674 LY A675 LS A676, LA A676, LO A676, LY A676, LW A676 LS A679, LY A679, LG A679 - Hyper Micro SIDELED® LS Y876, LA Y876, LO Y876, LY Y876 LT Y87S - SmartLED LW L88C, LW L88S LB L89C, LB L89S, LG L890 LS L89K, LO L89K, LY L89K LS L896, LA L896, LO L896, LY L896 - TOPLED LS T670, LO T670, LY T670, LG T670, LP T670 LSG T670, LSP T670, LSY T670, LOP T670, LYG T670 LG T671, LOG T671, LSG T671 LB T673, LV T673, LT T673, LW T673 LH T674 LS T676, LA T676, LO T676, LY T676, LB T676, LH T676, LSB T676, LW T676 LB T67C, LV T67C, LT T67C, LS T67K, LO T67K, LY T67K, LW E67C LS E67B, LA E67B, LO E67B, LY E67B, LB E67C, LV E67C, LT E67C LW T67C LS T679, LY T679, LG T679 LS T770, LO T770, LY T770, LG T770, LP T770 LB T773, LV T773, LT T773, LW T773 LH T774 LS E675, LA E675, LY E675, LS T675 LS T776, LA T776, LO T776, LY T776, LB T776 LHGB T686 LT T68C, LB T68C - Hyper Mini TOPLED® LB M676 - Mini TOPLED Santana® LG M470 LS M47K, LO M47K, LY M47K Source: http://www.osram.convergy.de LUXEON: - LUMILED® LXK2-PW12-R00, LXK2-PW12-S00, LXK2-PW14-U00, LXK2-PW14-V00 LXK2-PM12-R00, LXK2-PM12-S00, LXK2-PM14-U00 LXK2-PE12-Q00, LXK2-PE12-R00, LXK2-PE12-S00, LXK2-PE14-T00, LXK2-PE14-U00 LXK2-PB12-K00, LXK2-PB12-L00, LXK2-PB12-M00, LXK2-PB14-N00, LXK2-PB14-P00, LXK2-PB14-Q00 LXK2-PR12-L00, LXK2-PR12-M00, LXK2-PR14-Q00, LXK2-PR14-R00 LXK2-PD12-Q00, LXK2-PD12-R00, LXK2-PD12-S00 LXK2-PH12-R00, LXK2-PH12-S00 LXK2-PL12-P00, LXK2-PL12-Q00, LXK2-PL12-R00 Source: www.luxeon.com KINGBRIGHT: KA-3528ASYC Source: www.kingbright.com
C1 C2 C10-C23 = resistor:C-US: CAPACITOR, American symbol
C1.1-C1.4 C2.1 C3.1-C3.4 C4.1 C5.1 C6.1 C7.1 C12.1 C12.2 C13.1 = rcl:C-US: CAPACITOR, American symbol
IC1 = xilinx_xc95XXXxl:XC95144XLTQG100
IC2 = am29-memory:AM29F040J: 4-Megabit FLASH MEMORY (512 K x 8 bit) 5 V-only
IC3 = xilinx_xc95XXXxl:XC9572XLTQG100
IC4 IC5 = commodore:65*51: ACIA. Capable of RS-232
IC6 IC7 = texas-jlb:TLC550: UART/FIFO
IC8-IC11 = maxim:MAX3232*: True RS-232 Transceivers 3.0V to 5.5V, Low-Power up to 1Mbps, Using Four 0.1µF External Capacitors Source: http://pdfserv.maxim-ic.com/en/ds/MAX3222-MAX3241.pdf; MPN: MAX3232CSE; OC_FARNELL: 9725490; OC_NEWARK: 90C2890
IC12 = SparkFun:V_REG_LM1117: Voltage Regulator LM1117 Standard adjustable voltage regulator but in SMD form. Spark Fun Electronics SKU : COM-00595
IC13 = crystal:ASE: 3.3Vdc CMOS SMD CRYSTAL CLOCK OSCILLATOR SOurce: www.abracon.com; OC_FARNELL: unknown; OC_NEWARK: unknown
PAK = coco:PROGRAM_PAK
R1 R3-R13 = rcl:R-US_: RESISTOR, American symbol
R2 = resistor:R-US_: RESISTOR, American symbol
S3 = switch:TL36WO: TINY SWITCH ON - ON Source: http://www2.produktinfo.conrad.com/datenblaetter/700000-724999/705152-da-01-de-Subminiaturschalter_TL_36WO.pdf
U1 = esp8266modules:ESP12: ESP8266 Wifi module 12
U$1 = esp8266modules:ESP01: ESP8266 Wifi module 01
X1 = coco:EXPANSION_PORT_COCO
X2 X3 = con-subd:M09?S: SUB-D; OC_FARNELL: unknown; OC_NEWARK: unknown